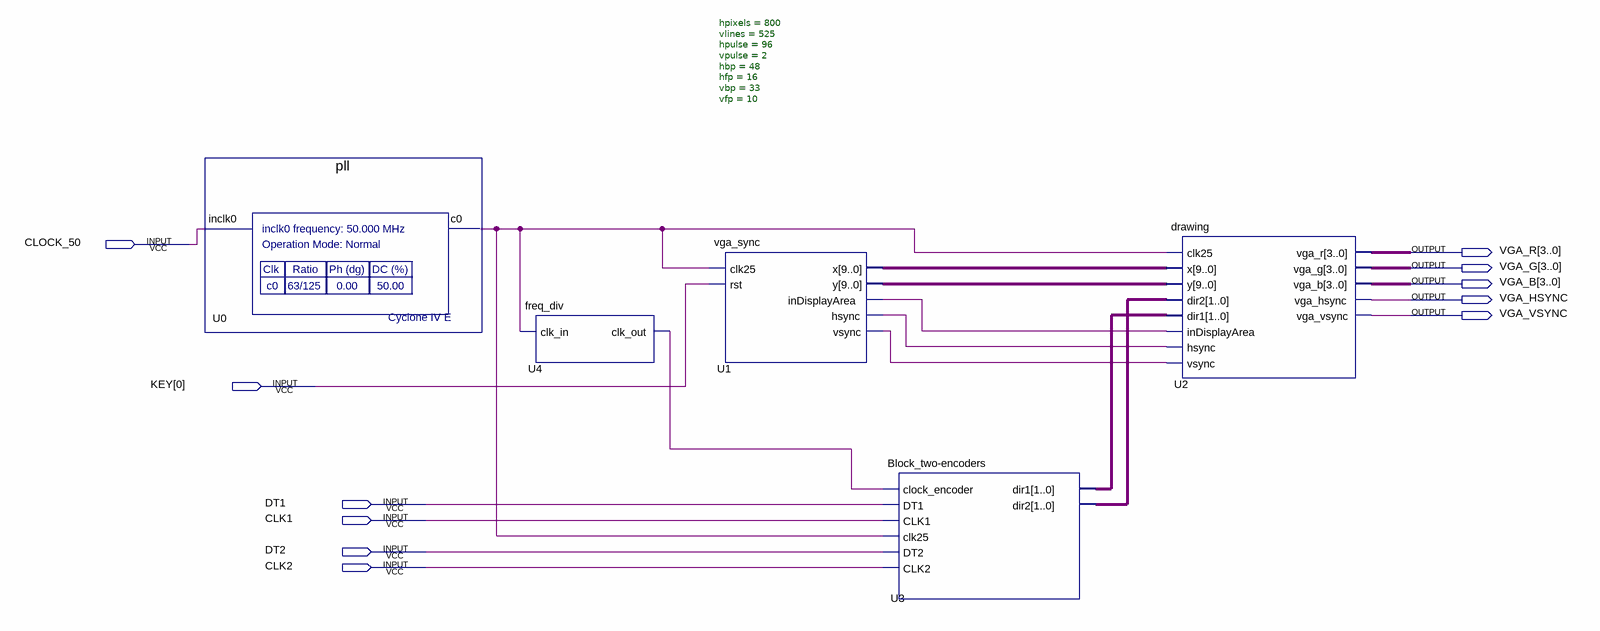
[diagram p0: schematic sheet]
// Quartus schematic Block_main.bdf as structural Verilog: 5 symbols, 11 pins
module Block_main (
  input  CLOCK_50,
  input  [0:0] KEY,
  input  DT1,
  input  CLK1,
  input  DT2,
  input  CLK2,
  output [3:0] VGA_R,
  output [3:0] VGA_G,
  output [3:0] VGA_B,
  output VGA_HSYNC,
  output VGA_VSYNC
);

  wire U0_c0, U1_hsync, U1_indisplayarea, U1_vsync, U4_clk_out;
  wire [1:0] U3_dir1, U3_dir2;
  wire [9:0] U1_x, U1_y;

  pll U0 (.inclk0(CLOCK_50), .c0(U0_c0));
  freq_div U4 (.clk_in(U0_c0), .clk_out(U4_clk_out));
  vga_sync #(.hpixels(800), .vlines(525), .hpulse(96), .vpulse(2), .hbp(48), .hfp(16), .vbp(33), .vfp(10)) U1 (
    .clk25(U0_c0), .rst(KEY[0]), .x(U1_x), .y(U1_y), .inDisplayArea(U1_indisplayarea), .hsync(U1_hsync),
    .vsync(U1_vsync));
  \Block_two-encoders  U3 (
    .clock_encoder(U4_clk_out), .DT1(DT1), .CLK1(CLK1), .clk25(U0_c0), .DT2(DT2), .CLK2(CLK2),
    .dir1(U3_dir1), .dir2(U3_dir2));
  drawing U2 (
    .clk25(U0_c0), .x(U1_x), .y(U1_y), .dir2(U3_dir2), .dir1(U3_dir1), .inDisplayArea(U1_indisplayarea),
    .hsync(U1_hsync), .vsync(U1_vsync), .vga_r(VGA_R), .vga_g(VGA_G), .vga_b(VGA_B), .vga_hsync(VGA_HSYNC),
    .vga_vsync(VGA_VSYNC));
endmodule
